# Altium schematic sheet PWM-SWITCH.SchDoc
size A4
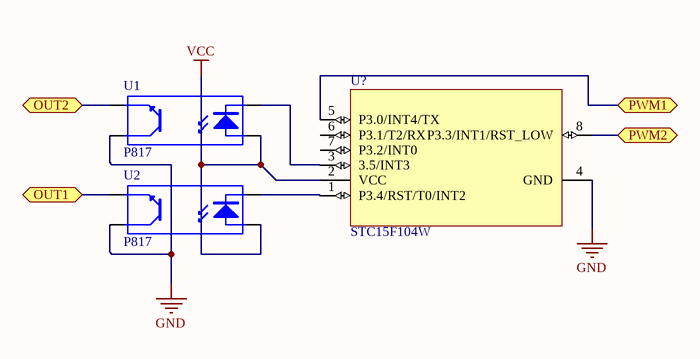
[diagram p0: PWM-SWITCH.SchDoc]

## Parts
U1  P817  [DIP-4]
U2  P817  [DIP-4]
U?  STC15F104W  [8P3]

## Ports
OUT1, OUT2, PWM1, PWM2

## Nets
GND: U1.4(C) U2.4(C) U?.4(GND)
VCC: U1.1(A) U2.1(A) U?.2(VCC)
OUT1: U2.3(E) ; port OUT1
OUT2: U1.3(E) ; port OUT2
PWM1: U?.5(P3.0/INT4/TX) ; port PWM1
PWM2: U?.8(P3.3/INT1/RST_LOW) ; port PWM2
NetU1_2: U1.2(K) U?.3(3.5/INT3)
NetU2_2: U2.2(K) U?.1(P3.4/RST/T0/INT2)

Not connected (* = marked no-connect by the designer): U? 6(P3.1/T2/RX) 7(P3.2/INT0)

## Library data of the parts
U1 U2 = Optoisolator1: 4-Pin Phototransistor Optocoupler; Published: 24-Mar-1999; LatestRevisionDate: 04-Mar-2005; LatestRevisionNote: Sch pins 3 & 4 Swapped.; DatasheetVersion: Nov-2003; PackageReference: DIP-4; Publisher: Altium Limited
U? = ATtiny15L-1PC: 8-Bit AVR Microcontroller with 1K Byte of Flash Memory; Published: 17-Sep-2003; LatestRevisionDate: 04-Mar-2005; LatestRevisionNote: Stylized 3D Model Added.; DatasheetVersion: 1187E-AVR-06/02; PackageVersion: revB, Sep-2001; PackageReference: 8P3; Publisher: Altium Limited; PackageDescription: DIP; 8 Leads; Row Spacing 7.62 mm; Pitch 2.54 mm; ComponentLink1Description: Manufacturer Link; ComponentLink1URL: http://www.atmel.com; ComponentLink2Description: Datasheet; ComponentLink2URL: http://www.atmel.com/dyn/resources/prod_documents/doc1187.pdf